# EAGLE schematic RAM (EAGLE 9.5.0)
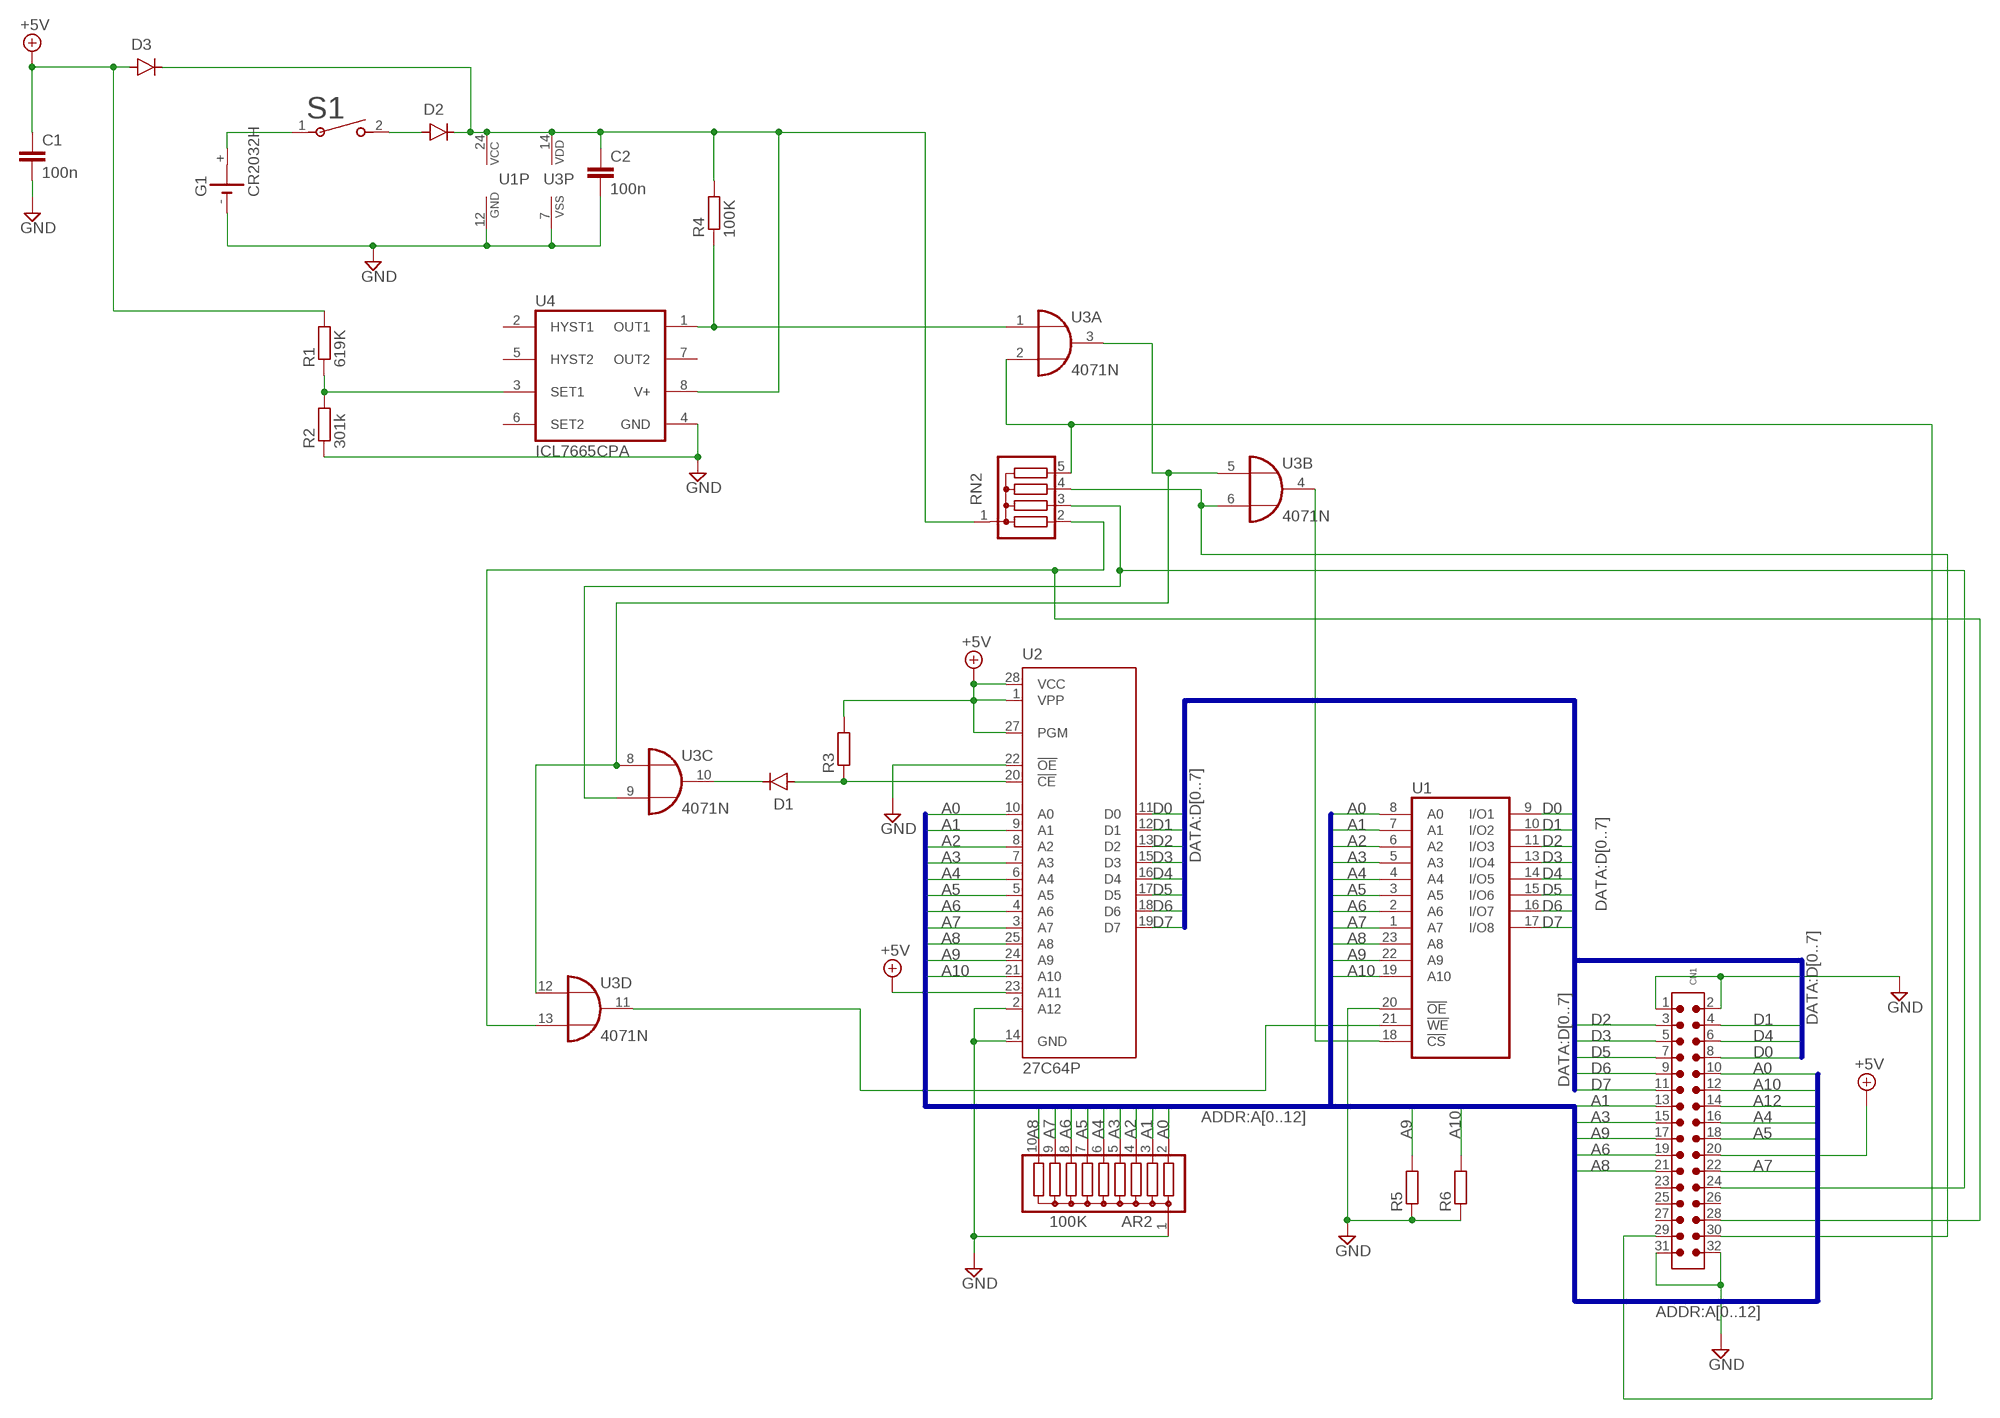
[diagram p0: schematic, sheet 1]

## Parts
AR2  100K  G09R  [SIL10]
C1  100n  C-EU050-024X044  [C050-024X044]
C2  100n  C-EU050-024X044  [C050-024X044]
CN1  6130XX21121_61303221121  [61303221121]
D1  1N4007  [DO-41]
D2  1N4007  [DO-41]
D3  1N4007  [DO-41]
G1  CR2032H  [CR2032H]
R1  619K  R-EU_0204/7  [0204/7]
R2  301k  R-EU_0204/7  [0204/7]
R3  R-EU_0204/7  [0204/7]
R4  100K  R-EU_0204/7  [0204/7]
R5  R-EU_0204/7  [0204/7]
R6  R-EU_0204/7  [0204/7]
RN2  G04R  [SIL5]
S1  1825966-1  [SWDIP2_256X170P100]
U1  6116P  [DIL24-6]
U2  27C64P  [DIL28-6]
U3  4071N  [DIL14]
U4  ICL7665CPA  [DIL08]

## Nets
+5V: C1.1 CN1.20 D3.A R1.2 R3.2 U2.1(VPP) U2.23(A11) U2.27(PGM) U2.28(VCC)
A0: AR2.2 CN1.10 U1.8(A0) U2.10(A0)
A1: AR2.3 CN1.13 U1.7(A1) U2.9(A1)
A2: AR2.4 U1.6(A2) U2.8(A2)
A3: AR2.5 CN1.15 U1.5(A3) U2.7(A3)
A4: AR2.6 CN1.16 U1.4(A4) U2.6(A4)
A5: AR2.7 CN1.18 U1.3(A5) U2.5(A5)
A6: AR2.8 CN1.19 U1.2(A6) U2.4(A6)
A7: AR2.9 CN1.22 U1.1(A7) U2.3(A7)
A8: AR2.10 CN1.21 U1.23(A8) U2.25(A8)
A9: CN1.17 R5.2 U1.22(A9) U2.24(A9)
A10: CN1.12 R6.2 U1.19(A10) U2.21(A10)
A12: CN1.14
D0: CN1.8 U1.9(I/O1) U2.11(D0)
D1: CN1.4 U1.10(I/O2) U2.12(D1)
D2: CN1.3 U1.11(I/O3) U2.13(D2)
D3: CN1.5 U1.13(I/O4) U2.15(D3)
D4: CN1.6 U1.14(I/O5) U2.16(D4)
D5: CN1.7 U1.15(I/O6) U2.17(D5)
D6: CN1.9 U1.16(I/O7) U2.18(D6)
D7: CN1.11 U1.17(I/O8) U2.19(D7)
GND: AR2.1 C1.2 C2.2 CN1.1 CN1.2 CN1.31 CN1.32 G1.- R2.1 R5.1 R6.1 U1.12(GND) U1.20(!OE) U2.2(A12) U2.14(GND) U2.22(!OE) U3.7(P:VSS) U4.4(GND)
N$1: G1.+ S1.1
N$2: D2.A S1.2
N$3: C2.1 D2.C D3.C R4.2 RN2.1 U1.24(VCC) U3.14(P:VDD) U4.8(V+)
N$4: R1.1 R2.2 U4.3(SET1)
N$5: R4.1 U3.1(A:I0) U4.1(OUT1)
N$6: D1.A R3.1 U2.20(!CE)
N$7: U1.18(!CS) U3.4(B:O)
N$8: CN1.24 RN2.3 U3.9(C:I1)
N$9: U3.3(A:O) U3.5(B:I0) U3.8(C:I0) U3.12(D:I0)
N$10: CN1.28 RN2.2 U3.13(D:I1)
N$11: D1.C U3.10(C:O)
N$12: CN1.29 RN2.5 U3.2(A:I1)
N$13: CN1.30 RN2.4 U3.6(B:I1)
N$14: U1.21(!WE) U3.11(D:O)
Unconnected: CN1.23 CN1.25 CN1.26 CN1.27 G1.+@1(+) U2.26(NC) U4.2(HYST1) U4.5(HYST2) U4.6(SET2) U4.7(OUT2)

## Buses
DATA:D[0..7]
ADDR:A[0..12]

## Library data of the parts
AR2 = resistor-sil:G09R: SIL RESISTOR; OC_FARNELL: unknown; OC_NEWARK: unknown
C1 C2 = rcl:C-EU: CAPACITOR, European symbol; SPICEPREFIX: C
CN1 = Wurth_Connectors_WR-PHD:6130XX21121_61303221121: WR-PHD 2.54 mm THT Dual Pin Header ARTICLE PROPERTIES: Pins:4;​ 6;​ 8;​ 10;​ 12;​ 14;​ 16;​ 18;​ 20;​ 22;​ 24;​ 26;​ 28;​ 30;​ 32;​ 34;​ 36;​ 40;​ 44;​ 64;​ 72;​ 80 KIND PROPERTIES: Pitch：2.54 mm Quality Class:3 as per CECC 75 301-802 Rows：Dual Gender：Pin Header Type：Board Stacker MATERIAL PROPERTIES: Insulator Material :PA6T Insulator Flammability Rating:UL94 V-0 Contact Material:Copper Alloy Contact Plating:Gold Contact Type:Stamped GENERAL INFORMATION Operating Temperature:-40 up to +105 °C Compliance:Lead free / RoHS ELECTRICAL PROPERTIES: Rated Current:3 A IR 1:3 A Withstanding Voltage:500 V (AC) Contact Resistance:20 mΩ RISO:1000 MΩ CERTIFICATION UL Approval:E323964 PACKAGING PROPERTIES Packaging:Bag <https://katalog.we-online.com/media/images/v2/o33215v209%20Family_WR-PHD_6130xx21121.jpg> Details see: https://katalog.we-online.com/en/em/PHD_2_54_THT_DUAL_PIN_HEADER_6130XX21121 Updated by Yingchun,Shan 2019-10-16 2019 (C) Würth Elektronik; DATASHEET-URL: https://katalog.we-online.com/em/datasheet/61303221121.pdf; GENDER: Pin Header; IR: 3A; MATES: WR-PHD 2.54mm Angled DualSocket Header/Dual Socket Header/Dual Socket Header Bottom Entry/Dual Socket Header Bottom Entry Large/SMT Dual Socket Header/SMT Dual Socket Header Bottom Entry; PACKAGING: Bag; PART-NUMBER: 61303221121; PINS: 32; ROWS: Dual; TYPE: Board Stacker
D1-D3 = Diodes:1N4007: DIODE GEN PURP 1KV 1A DO41 Manufacturer's datasheet <https://www.mccsemi.com/pdf/Products/1N4001-1N4007(DO-41).pdf>; CREATED_BY: PCBLayout.com; DIGIKEY_PART_NUMBER: 1N4007MSCT-ND; MANUFACTURER: Micro Commercial Co; MPN: 1N4007; PACKAGE: DO-41
G1 = battery:CR2032H: LI BATTERY Varta
R1-R6 = resistor:R-EU_: RESISTOR, European symbol
RN2 = resistor-sil:G04R: SIL RESISTOR; OC_FARNELL: unknown; OC_NEWARK: unknown
S1 = Switches:1825966-1; BUILT_BY: EMA_UL_Team; CATEGORY: Tactile Switches; COPYRIGHT: Copyright (C) 2016 Accelerated Designs. All rights reserved; DESCRIPTION: FSMCH=3.5 X 6.0 X 4.3 TACT SWITCH, HT; MANUFACTURER_PART_NUMBER: 1825966-1; PART_STATUS: active; SERIES: Unknown; VENDOR: TE Connectivity
U1 = memory-idt:6116P: MEMORY; OC_FARNELL: unknown; OC_NEWARK: unknown
U2 = microchip:27*64: CMOS EPROM 64 K (8 K x 8), low voltage; MF: Arrow Electronics; MPN: M27C64A-10F1; OC_FARNELL: 1094265; OC_NEWARK: 93K7339
U3 = 40xx:4071: Quad 2-input OR
U4 = maxim:ICL7665CPA: UNDER/OVER VOLTAGE DETECTOR; OC_FARNELL: unknown; OC_NEWARK: unknown